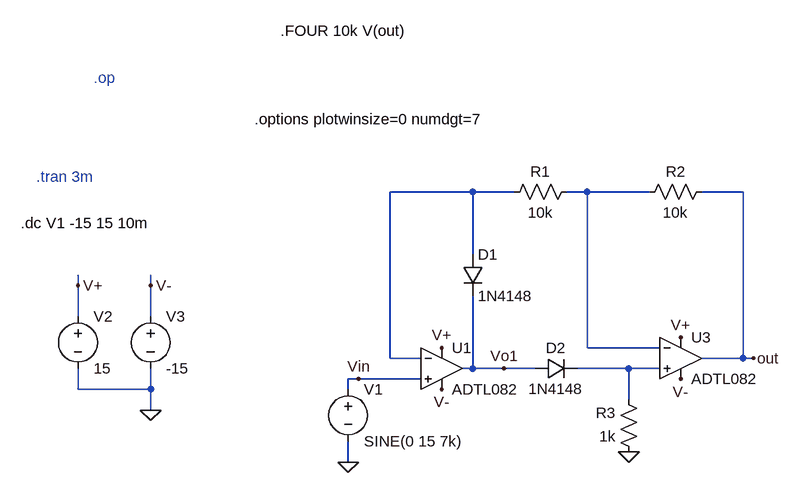
[diagram p0: schematic redresor_ver2.asc]
redresor_ver2.asc, the LTspice schematic file:
Version 4
SHEET 1 956 680
WIRE 112 -496 -16 -496
WIRE 176 -496 112 -496
WIRE 288 -496 256 -496
WIRE 384 -496 288 -496
WIRE 528 -496 464 -496
WIRE 112 -400 112 -496
WIRE -496 -352 -496 -368
WIRE -384 -352 -384 -368
WIRE -496 -304 -496 -352
WIRE -384 -304 -384 -352
WIRE 288 -256 288 -496
WIRE 400 -256 288 -256
WIRE -16 -240 -16 -496
WIRE 32 -240 -16 -240
WIRE 528 -240 528 -496
WIRE 528 -240 464 -240
WIRE 544 -240 528 -240
WIRE 112 -224 112 -336
WIRE 112 -224 96 -224
WIRE 160 -224 112 -224
WIRE 208 -224 160 -224
WIRE 352 -224 272 -224
WIRE 400 -224 352 -224
WIRE -64 -208 -80 -208
WIRE 32 -208 -64 -208
WIRE -496 -192 -496 -224
WIRE -384 -192 -384 -224
WIRE -384 -192 -496 -192
WIRE -80 -192 -80 -208
WIRE 352 -176 352 -224
WIRE -384 -160 -384 -192
WIRE -80 -80 -80 -112
FLAG -80 -80 0
FLAG -384 -160 0
FLAG -496 -352 V+
FLAG -384 -352 V-
FLAG -64 -208 Vin
FLAG 64 -192 V-
FLAG 64 -256 V+
FLAG 432 -208 V-
FLAG 432 -272 V+
FLAG 544 -240 out
FLAG 160 -224 Vo1
FLAG 352 -96 0
DATAFLAG 288 -496 ""
SYMBOL voltage -80 -208 R0
WINDOW 123 24 44 Left 2
WINDOW 39 0 0 Left 2
SYMATTR InstName V1
SYMATTR Value SINE(0 15 7k)
SYMBOL voltage -496 -320 R0
WINDOW 123 0 0 Left 2
WINDOW 39 0 0 Left 2
SYMATTR InstName V2
SYMATTR Value 15
SYMBOL voltage -384 -320 R0
WINDOW 123 0 0 Left 2
WINDOW 39 0 0 Left 2
SYMATTR InstName V3
SYMATTR Value -15
SYMBOL res 272 -512 R90
WINDOW 0 0 56 VBottom 2
WINDOW 3 32 56 VTop 2
SYMATTR InstName R1
SYMATTR Value 10k
SYMBOL res 368 -480 R270
WINDOW 0 32 56 VTop 2
WINDOW 3 0 56 VBottom 2
SYMATTR InstName R2
SYMATTR Value 10k
SYMBOL res 368 -80 R180
WINDOW 0 36 76 Left 2
WINDOW 3 36 40 Left 2
SYMATTR InstName R3
SYMATTR Value 1k
SYMBOL OpAmps\\ADTL082 64 -288 R0
SYMATTR InstName U1
SYMBOL OpAmps\\ADTL082 432 -304 R0
SYMATTR InstName U3
SYMBOL diode 96 -400 R0
SYMATTR InstName D1
SYMATTR Value 1N4148
SYMBOL diode 208 -208 R270
WINDOW 0 32 32 VTop 2
WINDOW 3 0 32 VBottom 2
SYMATTR InstName D2
SYMATTR Value 1N4148
TEXT -560 -520 Left 2 ;.tran 3m
TEXT -584 -448 Left 2 !.dc V1 -15 15 10m
TEXT -472 -672 Left 2 ;.op
TEXT -184 -744 Left 2 !.FOUR 10k V(out)
TEXT -224 -608 Left 2 !.options plotwinsize=0 numdgt=7

The netlist it stands for:
* redresor_ver2.asc
V1 Vin 0 SINE(0 15 7k)
V2 V+ 0 15
V3 V- 0 -15
R1 N002 N001 10k
R2 N002 out 10k
R3 0 N003 1k
XU1 Vin N001 V+ V- Vo1 ADTL082  ; pins In+ In- V+ V- OUT
XU3 N003 N002 V+ V- out ADTL082  ; pins In+ In- V+ V- OUT
D1 N001 Vo1 1N4148
D2 Vo1 N003 1N4148
.model D D
.lib standard.dio
* .tran 3m
.dc V1 -15 15 10m
* .op
.FOUR 10k V(out)
.options plotwinsize=0 numdgt=7
.lib ADI.lib
.backanno
.end